# Altium schematic sheet Лист2.SchDoc
size 420 x 297 mm; Author: ALTIUM GOSTBOM2.0 KEV; SheetNumber: 2; SheetTotal: 4; Обозначение_Код: ФЮРА.442576.001 Э3
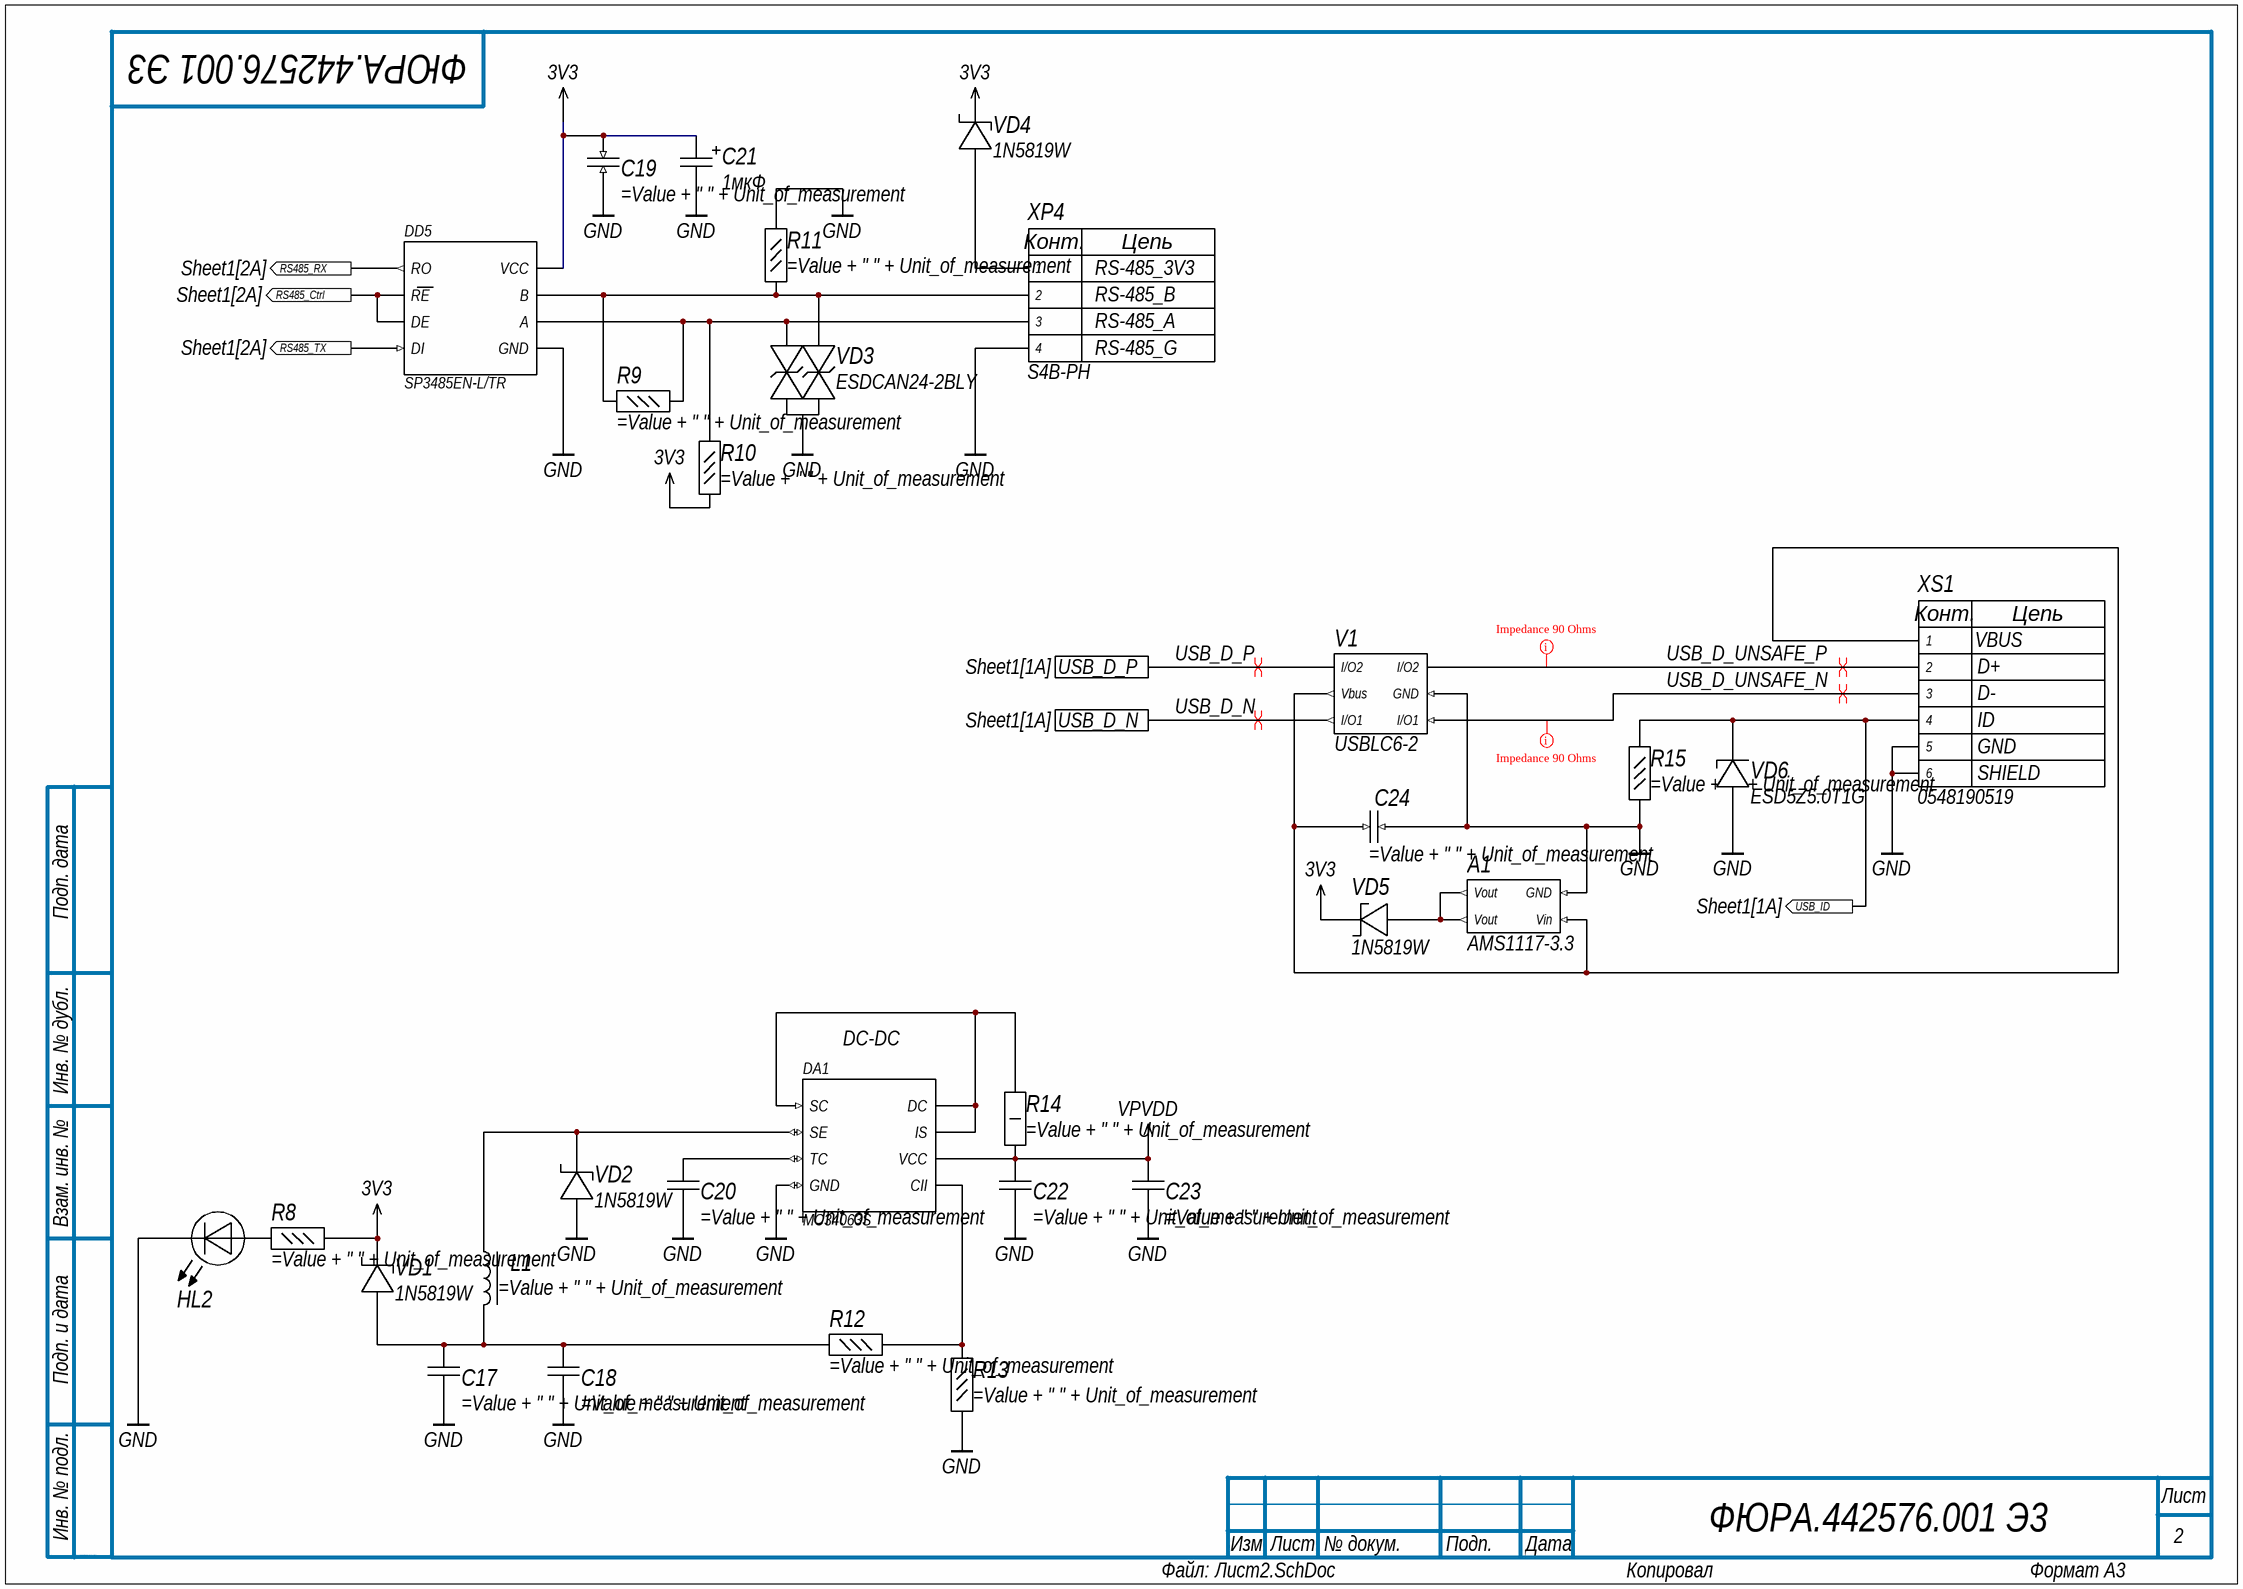
[diagram p0: Лист2.SchDoc]

## Parts
A1  AMS1117-3.3  [SOT-223]
C17  (no value)  [CAP_1206]
C18  (no value)  [CAP_1206]
C19  (no value)  [CAP_0603]
C20  (no value)  [CAP_0603]
C21  1мкФ  [TECAP_A]
C22  (no value)  [CAP_1206]
C23  (no value)  [CAP_1206]
C24  (no value)  [CAP_0603]
DA1  MC34063S  [SOP-8 WithoutTP]
DD5  SP3485EN-L/TR  [SOIC-8 WIthoutTP]
HL2  3  [LED_0805]  (value not drawn)
L1  (no value)  [CD54]
R8  (no value)  [RES_0603]
R9  (no value)  [RES_0603]
R10  (no value)  [RES_0603]
R11  (no value)  [RES_0603]
R12  (no value)  [RES_0603]
R13  (no value)  [RES_0603]
R14  (no value)  [RES_2512]
R15  (no value)  [RES_0603]
V1  USBLC6-2  [SOT23-6]
VD1  1N5819W  [SOD-123]
VD2  1N5819W  [SOD-123]
VD3  ESDCAN24-2BLY  [SOT23]
VD4  1N5819W  [SOD-123]
VD5  1N5819W  [SOD-123]
VD6  ESD5Z5.0T1G  [SOD-523]
XP4  S4B-PH  [S4B-PH]
XS1  0548190519  [USB_Mini_B_TH]

## Ports
RS485_Ctrl (out, see Sheet1[2A]), RS485_RX (out, see Sheet1[2A]), RS485_TX (out, see Sheet1[2A]), USB_D_N (see Sheet1[1A]), USB_D_P (see Sheet1[1A]), USB_ID (out, see Sheet1[1A])

## Nets
3V3: C19.2 C21.1 DD5.8(VCC) R8.1 R10.2 VD1.1 VD4.1 VD5.1
GND: A1.1(GND) C17.1 C18.1 C19.1 C20.1 C21.2 C22.1 C23.1 C24.1 DA1.4(GND) DD5.5(GND) HL2.C R11.2 R13.1 R15.1 V1.2(GND) VD2.2 VD3.3 VD6.2 XP4.4 XS1.1(5) XS1.6
VPVDD: C22.2 C23.2 DA1.6(VCC) R14.1
RS485_Ctrl: DD5.2(RE) DD5.3(DE) ; port RS485_Ctrl
RS485_RX: DD5.1(RO) ; port RS485_RX
RS485_TX: DD5.4(DI) ; port RS485_TX
USB_D_N: V1.6(I/O1) ; port USB_D_N
USB_D_P: V1.4(I/O2) ; port USB_D_P
USB_D_UNSAFE_N: V1.1(I/O1) XS1.4(3)
USB_D_UNSAFE_P: V1.3(I/O2) XS1.3(2)
USB_ID: R15.2 VD6.1 XS1.2(4) ; port USB_ID
NetA1_2: A1.2(Vout) A1.4(Vout) VD5.2
NetA1_3: A1.3(Vin) C24.2 V1.5(Vbus) XS1.5(1)
NetC17_2: C17.2 C18.2 L1.2 R12.1 VD1.2
NetC20_2: C20.2 DA1.3(TC)
NetDA1_1: DA1.1(SC) DA1.7(IS) DA1.8(DC) R14.2
NetDA1_2: DA1.2(SE) L1.1 VD2.1
NetDA1_5: DA1.5(CII) R12.2 R13.2
NetDD5_6: DD5.6(A) R9.2 R10.1 VD3.2 XP4.3
NetDD5_7: DD5.7(B) R9.1 R11.1 VD3.1 XP4.2
NetHL2_A: HL2.A R8.2
NetVD4_2: VD4.2 XP4.1

## Layout directives
differential pair: USB_D_N, USB_D_P, USB_D_UNSAFE_N, USB_D_UNSAFE_P
mark named Impedance 90 Ohms: USB_D_UNSAFE_N, USB_D_UNSAFE_P

## Notes on the sheet
- RS-485_3V3
- RS-485_B
- RS-485_A
- RS-485_G
- (near DA1) DC-DC
- Подп. дата
- Инв. № дубл.
- Взам. инв. №
- Подп. и дата
- Инв. № подл.
- Изм.
- Лист
- № докум.
- Подп.
- Дата
- ALTIUM GOSTBOM2.0 KEV
- Файл:
- Копировал
- Формат А3
- (in symbol 0548190519) Конт.; Цепь; VBUS; D+; D-; ID; GND; SHIELD
- (in symbol S4B-PH) Конт.; Цепь

## Library data of the parts
A1 = AMS1117-3.3: Линейный регулятор с малым падением напряжения, 1А, 3.3В [SOT-223]
C17 C18 C22 C23 = CAP_1206: Конденсатор керамический, типоразмера 1206; Value: 10; Unit_of_measurement: мкФ 50В; ComponentLink1Description: New link; ComponentLink1URL: *
C19 C24 = CAP_0603: Конденсатор керамический, типоразмера 0603; Value: 100; Unit_of_measurement: нФ; ComponentLink1Description: New link; ComponentLink1URL: *
C20 = CAP_0603: Конденсатор керамический, типоразмера 0603; Value: 3.9; Unit_of_measurement: нФ; ComponentLink1Description: New link; ComponentLink1URL: *
C21 = TECAP_A: Описание свойств компонента; Value: 1; Unit_of_measurement: мкФ
DA1 = MC34063S: The MC34063is a monolithic regulator subsystem, / intended for use as DC to DC converter. This device contains a / temperature compensated band gap reference, a duty-cycle / control oscillator, driver and high current output switch. It can be / used for step down, step-up or inverting switching regulators as / well as for series pass regulators.
DD5 = SP3485EN: Трансивер RS485 Half-Duplex 1/1
HL2 = LED_0805_R: Светодиод SMD 0805=2x1.3мм, красный, 28мкд, 130град, прозрачная линза; Q-15575B СД SMD02013C2\кр\ 28,5\130\пр\FYLS- 0805HD\FORYARD; Unit_of_measurement: Ом; Value: *; ComponentLink1Description: New link; ComponentLink1URL: *
L1 = IND_CD54: Резистор, типоразмера 2010; Value: 47; Unit_of_measurement: мкГн; ComponentLink1Description: New link; ComponentLink1URL: *
R8 = RES_0603: Резистор, типоразмера 0603; Value: 330; Unit_of_measurement: Ом; ComponentLink1Description: New link; ComponentLink1URL: *
R9 = RES_0603: Резистор, типоразмера 0603; Value: 120; Unit_of_measurement: Ом; ComponentLink1Description: New link; ComponentLink1URL: *
R10 R11 = RES_0603: Резистор, типоразмера 0603; Value: 4.7; Unit_of_measurement: кОм; ComponentLink1Description: New link; ComponentLink1URL: *
R12 = RES_0603: Резистор, типоразмера 0603; Value: 8.2; Unit_of_measurement: кОм 1%; ComponentLink1Description: New link; ComponentLink1URL: *
R13 = RES_0603: Резистор, типоразмера 0603; Value: 5; Unit_of_measurement: кОм 1%; ComponentLink1Description: New link; ComponentLink1URL: *
R14 = RES_2512: Резистор, типоразмера 2512; Value: 0.2; Unit_of_measurement: Ом 1%; ComponentLink1Description: New link; ComponentLink1URL: *
R15 = RES_0603: Резистор, типоразмера 0603; Value: 100; Unit_of_measurement: кОм; ComponentLink1Description: New link; ComponentLink1URL: *
V1 = USBLC6-2: Защита интерфейса USB от электростатических разрядов [SOT-23-6]
VD1 VD2 VD4 VD5 = 1N5819W: Диод Шоттки, 40 В, 0.35 А, SOD-123; Unit_of_measurement: Ом; Value: *; ComponentLink1Description: New link; ComponentLink1URL: *
VD3 = ESDCAN24-2BLY: Устройство защиты CAN шины от ESD, 2 защитных диода [SOT-23-3]; Unit_of_measurement: Ом; Value: *; ComponentLink1Description: New link; ComponentLink1URL: *
VD6 = ESD5Z5.0T1G: Устройство защиты от ESD, защитный диод, 5В [SOD-523]; Unit_of_measurement: Ом; Value: *; ComponentLink1Description: New link; ComponentLink1URL: *
XP4 = S4B-PH: JST PH 4pin 2 mm pitch; horizontal; through hole OR full smd; S4B-PH-SM4-TB
XS1 = 0548190519: USB - mini B USB 2.0 OTG Receptacle Connector 5 Position Through Hole, Right Angle